# EAGLE design MagEnc (EAGLE 5.11)
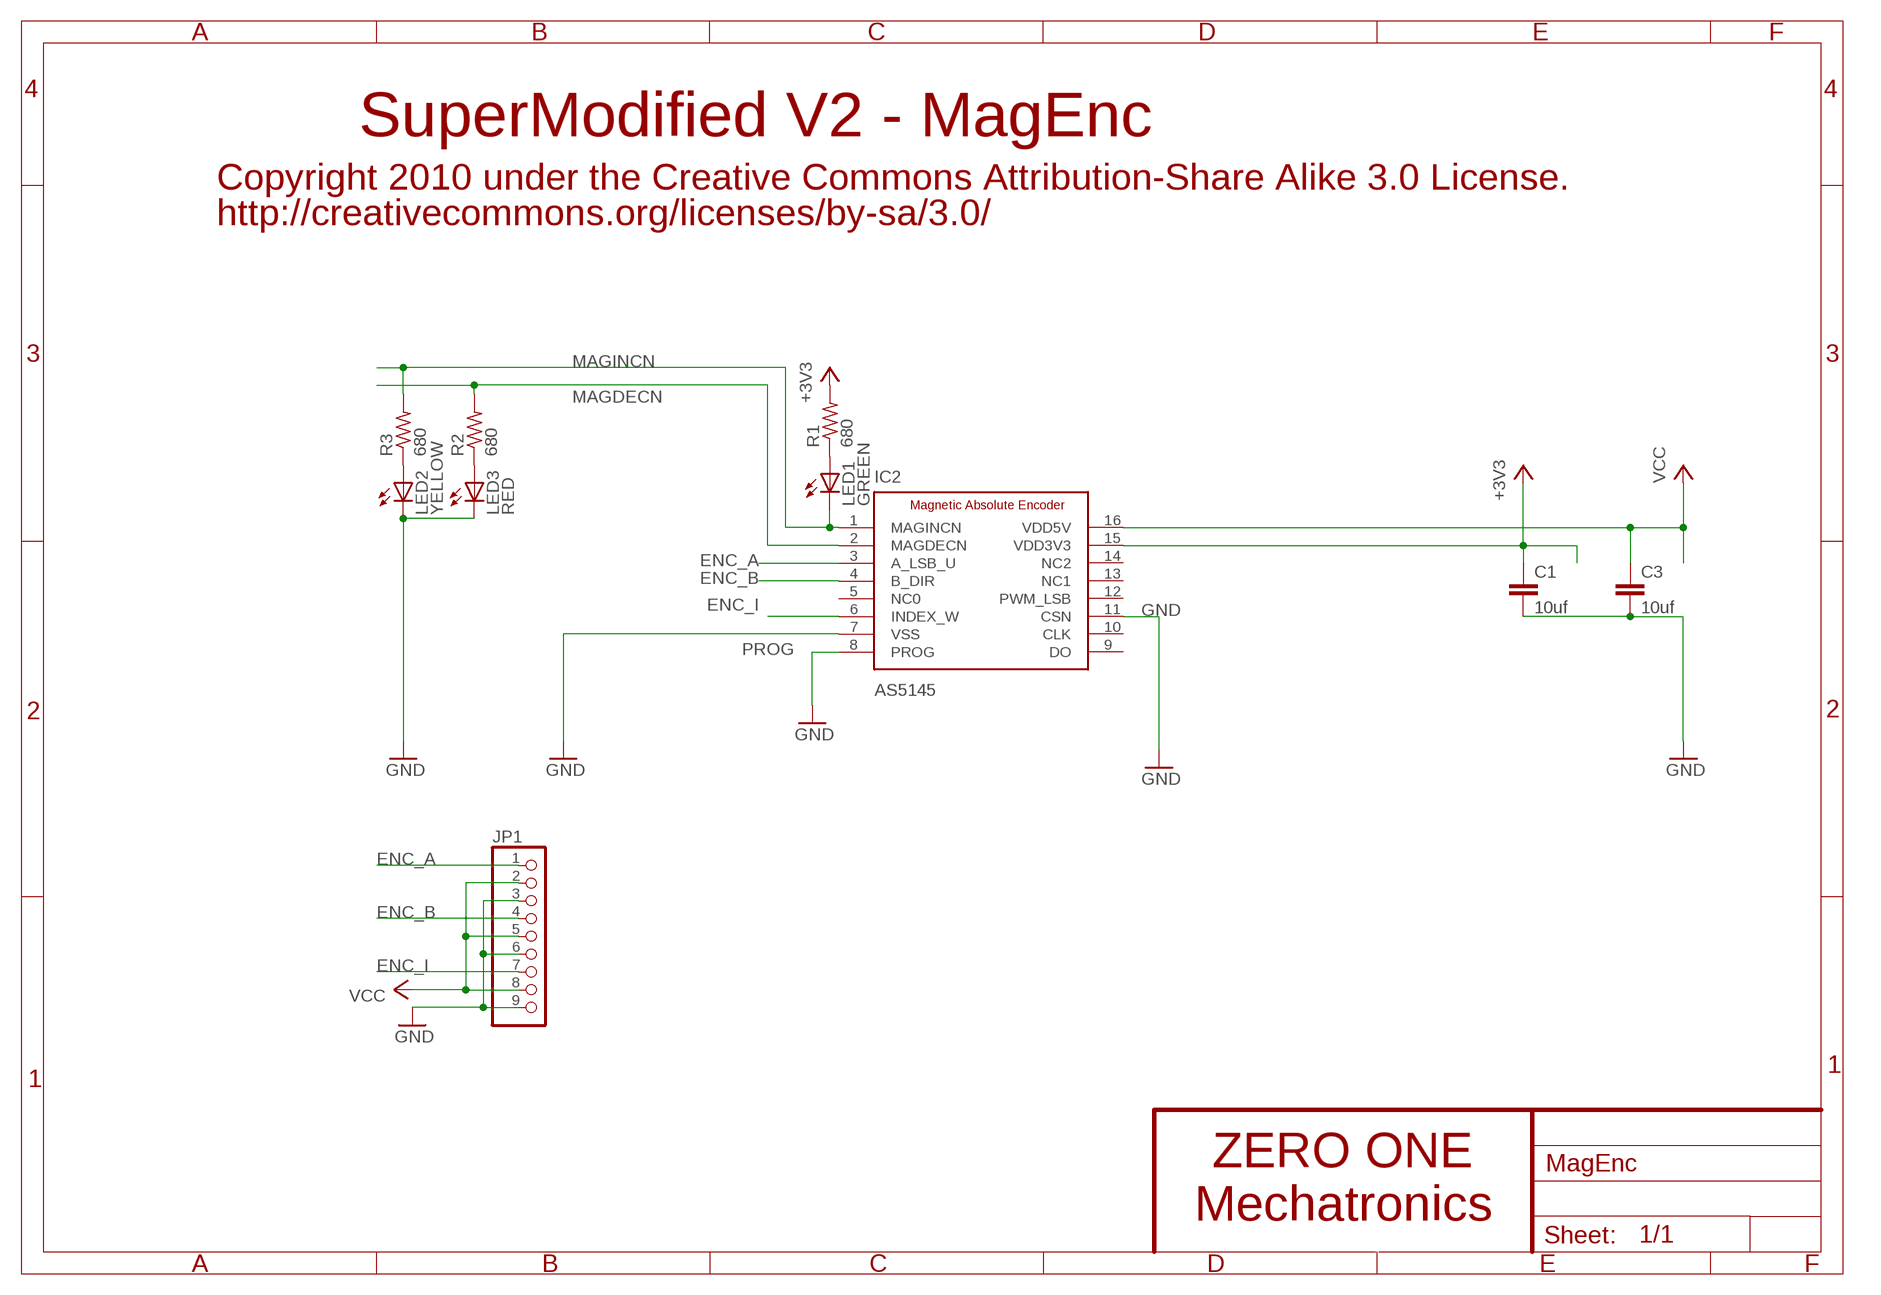
[diagram p0: schematic, sheet 1]

## Parts
C1  10uf  C-EUC0805K  [C0805K]
C3  10uf  C-EUC0805K  [C0805K]
IC2  AS5145  ADS5040  [SSOP16]
JP1  PINHD-1X9  [1X09]
LED1  GREEN  LEDCHIPLED_0805  [CHIPLED_0805]
LED2  YELLOW  LEDCHIPLED_0805  [CHIPLED_0805]
LED3  RED  LEDCHIPLED_0805  [CHIPLED_0805]
R1  680  R-US_R0603  [R0603]
R2  680  R-US_R0603  [R0603]
R3  680  R-US_R0603  [R0603]

## Nets
+3V3: C1.1 IC2.15(VDD3V3) R1.2
ENC_A: IC2.3(A_LSB_U) JP1.1
ENC_B: IC2.4(B_DIR) JP1.4
ENC_I: IC2.6(INDEX_W) JP1.7
GND: C1.2 C3.2 IC2.7(VSS) IC2.11(CSN) JP1.3 JP1.6 JP1.9 LED2.C LED3.C
MAGDECN: IC2.2(MAGDECN) R2.2
MAGINCN: IC2.1(MAGINCN) LED1.C R3.2
N$1: LED1.A R1.1
N$4: LED3.A R2.1
N$5: LED2.A R3.1
PROG: IC2.8(PROG) ; supply symbol labelled GND
VCC: C3.1 IC2.16(VDD5V) JP1.2 JP1.5 JP1.8
Unconnected: IC2.5(NC0) IC2.9(DO) IC2.10(CLK) IC2.12(PWM_LSB) IC2.13(NC1) IC2.14(NC2)

## Notes on the sheet
- SuperModified V2 - MagEnc
- Copyright 2010 under the Creative Commons Attribution-Share Alike 3.0 License.
- http://creativecommons.org/licenses/by-sa/3.0/
- ZERO ONE
- Mechatronics

## Library data of the parts
C1 C3 = rcl:C-EU: CAPACITOR, European symbol
IC2 = zo_TMS320DMC:ADS5040
JP1 = pinhead:PINHD-1X9: PIN HEADER
LED1-LED3 = led:LED: LED OSRAM: - CHIPLED LG R971, LG N971, LY N971, LG Q971, LY Q971, LO R971, LY R971 LH N974, LH R974 LS Q976, LO Q976, LY Q976 LO Q996 - Hyper CHIPLED LW Q18S LB Q993, LB Q99A, LB R99A - SideLED LS A670, LO A670, LY A670, LG A670, LP A670 LB A673, LV A673, LT A673, LW A673 LH A674 LY A675 LS A676, LA A676, LO A676, LY A676, LW A676 LS A679, LY A679, LG A679 - Hyper Micro SIDELED® LS Y876, LA Y876, LO Y876, LY Y876 LT Y87S - SmartLED LW L88C, LW L88S LB L89C, LB L89S, LG L890 LS L89K, LO L89K, LY L89K LS L896, LA L896, LO L896, LY L896 - TOPLED LS T670, LO T670, LY T670, LG T670, LP T670 LSG T670, LSP T670, LSY T670, LOP T670, LYG T670 LG T671, LOG T671, LSG T671 LB T673, LV T673, LT T673, LW T673 LH T674 LS T676, LA T676, LO T676, LY T676, LB T676, LH T676, LSB T676, LW T676 LB T67C, LV T67C, LT T67C, LS T67K, LO T67K, LY T67K, LW E67C LS E67B, LA E67B, LO E67B, LY E67B, LB E67C, LV E67C, LT E67C LW T67C LS T679, LY T679, LG T679 LS T770, LO T770, LY T770, LG T770, LP T770 LB T773, LV T773, LT T773, LW T773 LH T774 LS E675, LA E675, LY E675, LS T675 LS T776, LA T776, LO T776, LY T776, LB T776 LHGB T686 LT T68C, LB T68C - Hyper Mini TOPLED® LB M676 - Mini TOPLED Santana® LG M470 LS M47K, LO M47K, LY M47K Source: http://www.osram.convergy.de/
R1-R3 = rcl:R-US_: RESISTOR, American symbol

## Board
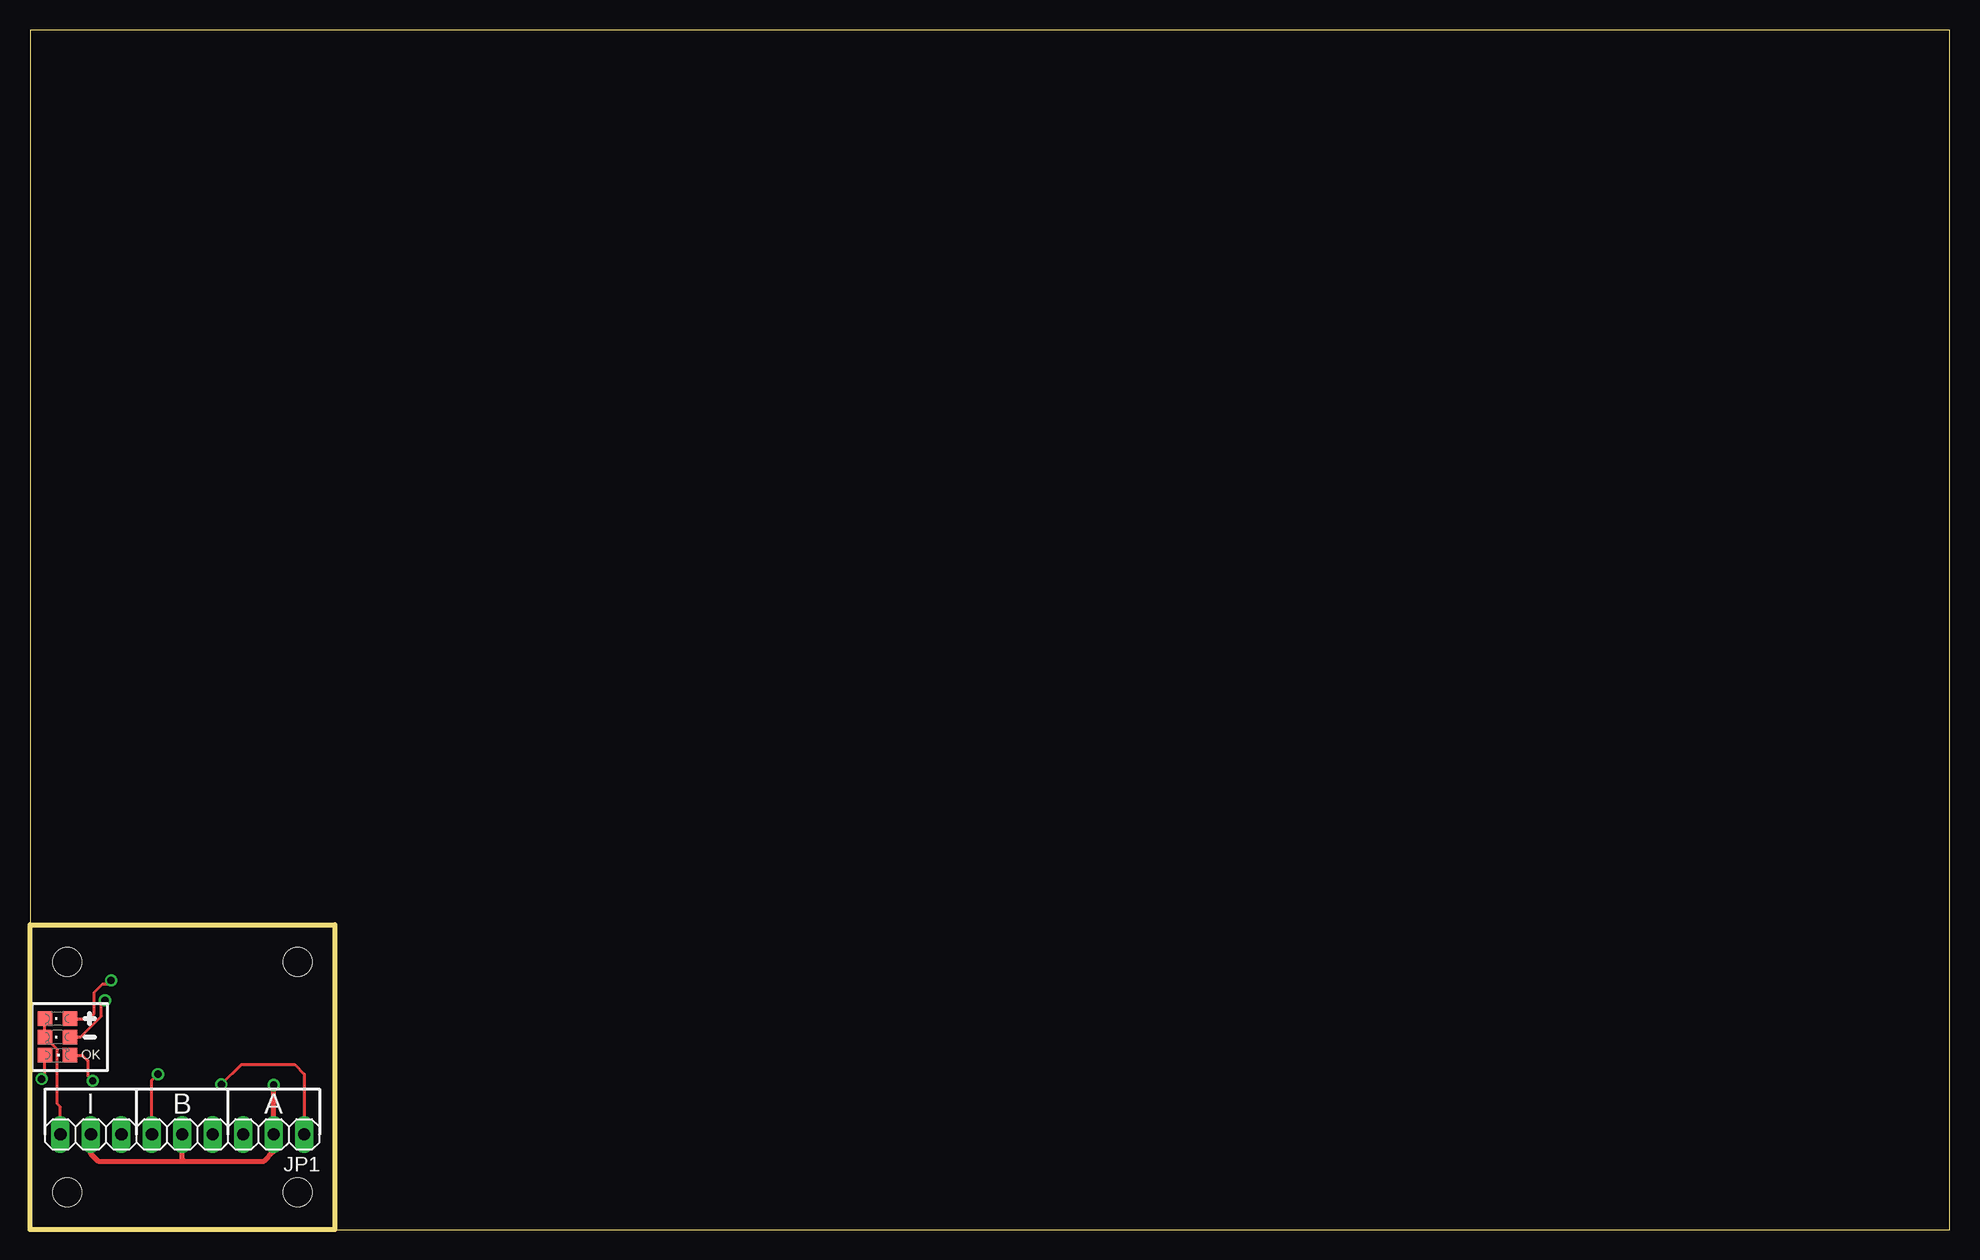
[diagram p1: board, top side]
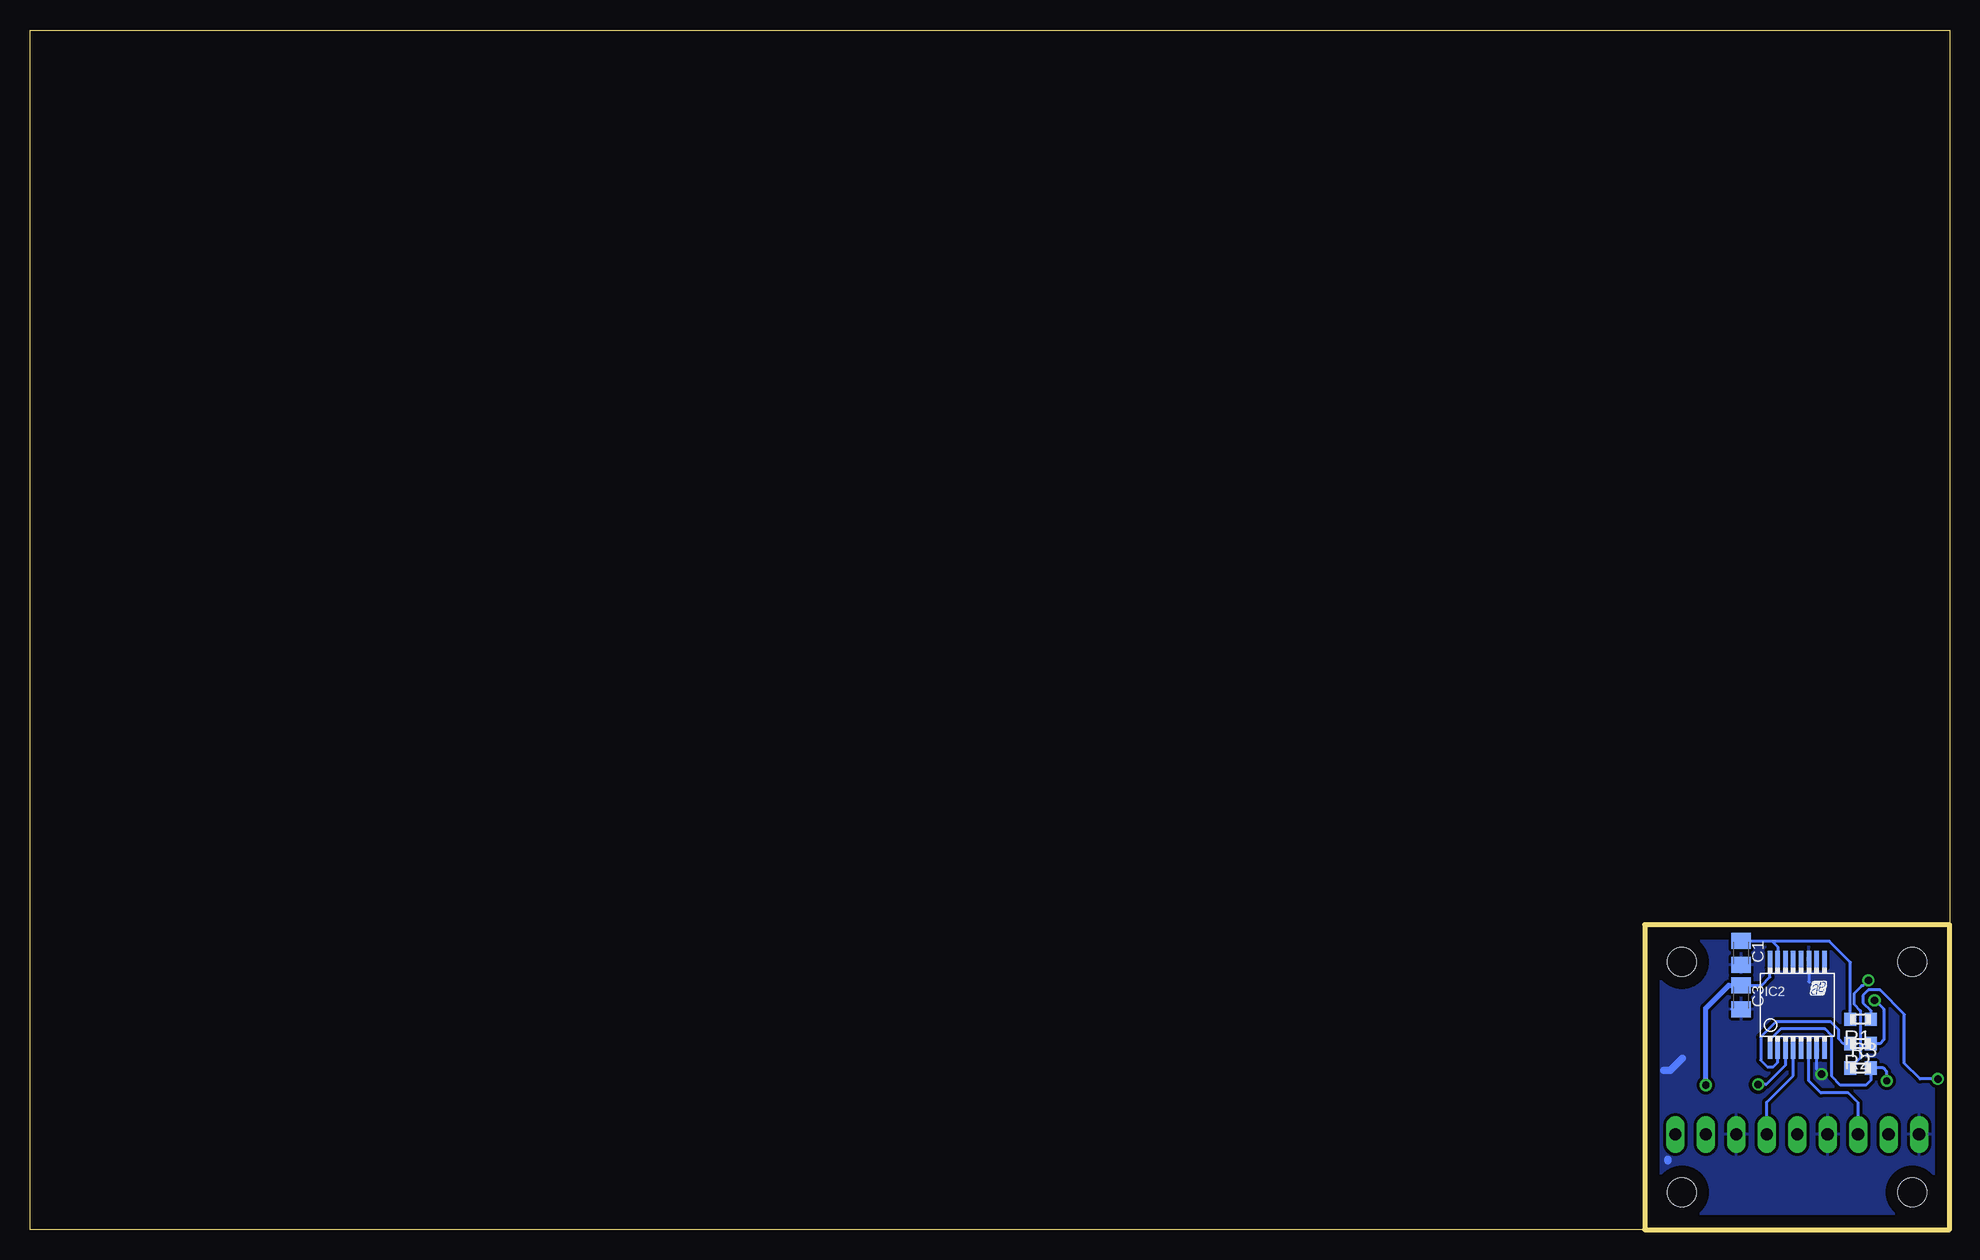
[diagram p2: board, bottom side, seen from below]

Size 160 x 100 mm. Coordinates in mm from the lower left corner, seen from the top.
Outline: 25.4,0 160,0 160,100 0,100 0,25.4
Outline: 0,25.4 0,0 25.4,0
Outline: 0,25.4 25.4,25.4 25.4,0
Copper layers (1*16): Top 0.035mm / dielectric 1.5mm / Bottom 0.035mm
Design rules "default": minimum track width 10mil, minimum drill 24mil, track to track 8mil, track to pad 8mil, pad to pad 8mil, via to via 8mil, smd to smd 8mil, copper to edge 40mil, drill to drill 8mil, minimum pad ring 10mil, minimum via ring 8mil, stop-mask expansion 4mil, vias tented up to drill 0mil, thermal gap 10mil
Holes 2.41 mm at -9.86,-1.88 3.1,22.3 22.3,22.3 3.1,3.1 22.3,3.1

### Footprints (pad centres in the part's own frame; a part is rotated, then mirrored left to right if it is on the bottom)
C0805K = smd 1.3 x 1.6: 1 -1,0; 2 1,0
SSOP16 = smd 0.381 x 1.422: 1 -2.275,-3.791; 2 -1.625,-3.791; 3 -0.975,-3.791; 4 -0.325,-3.791; 5 0.325,-3.791; 6 0.975,-3.791; 7 1.625,-3.791; 8 2.275,-3.791; 9 2.275,3.791; 10 1.625,3.791; 11 0.975,3.791; 12 0.325,3.791; 13 -0.325,3.791; 14 -0.975,3.791; 15 -1.625,3.791; 16 -2.275,3.791
1X09 = drill 1.016 long: 1 -10.16,0; 2 -7.62,0; 3 -5.08,0; 4 -2.54,0; 5 0,0; 6 2.54,0; 7 5.08,0; 8 7.62,0; 9 10.16,0
CHIPLED_0805 = smd 1.2 x 1.2: A 0,-1.05; C 0,1.05
R0603 = smd 1 x 1.1: 1 -0.85,0; 2 0.85,0

### Placement (x,y rotation side)
C1  17.37,23.06 270 bottom
C3  17.37,19.35 270 bottom
IC2  12.7,18.75 0 bottom
JP1  12.7,7.92 180 top
LED1  2.29,14.53 270 top
LED2  2.29,17.58 90 top
LED3  2.29,16.05 90 top
R1  7.42,17.53 180 bottom
R2  7.42,15.49 180 bottom
R3  7.42,13.46 0 bottom

### Tracks (layer width: path | path; a pad name or v marks a point on that pad's centre or on a via)
+3V3
  Bottom 0.254: C1.1 17.34,24.03 15.65,24.03 14.78,24.03 | 14.78,24.03 14.32,23.57 IC2.15 | R1.2 8.27,22.29 10.01,24.03 14.78,24.03
ENC_A  (via drill 0.6)
  Top 0.254: JP1.1 22.86,12.95 22.05,13.77 17.63,13.77 v15.95,12.09
  Bottom 0.254: IC2.3 13.68,13.71 15.29,12.09 v15.95,12.09
ENC_B
  Bottom 0.254: IC2.4 13.03,12.83 15.24,10.62 JP1.4
ENC_I
  Bottom 0.254: IC2.6 11.72,12.38 10.72,11.38 8.43,11.38 7.62,10.57 JP1.7
GND  (via drill 0.6)
  Top 0.254: LED2.C LED3.C 2.29,15 2.29,10.46 2.54,10.21 JP1.9 | v10.67,12.95 10.16,12.45 JP1.6
  Bottom 0.254: IC2.7 11.07,13.36 v10.67,12.95 | IC2.11 11.73,22.55 11.73,20.68 arc-90 11.68,20.62 | C3.2 18.17,18.36
  Bottom 0.61: 22.25,14.28 23.27,13.26 23.82,13.26 | 23.47,5.84 23.47,5.74
  pour Bottom (isolate 0.254): 0,25.4 25.4,25.4 25.4,0.05 0,0.05
MAGDECN
  Bottom 0.254: IC2.2 14.32,13.92 14.68,13.56 15.19,13.56 15.75,14.12 15.75,16.05 14.48,17.32 9.91,17.32 9.25,16.66 9.25,15.9 8.84,15.49 R2.2
MAGINCN  (via drill 0.6)
  Top 0.254: LED1.C 4.37,14.53 4.83,14.07 4.83,12.8 v5.23,12.39
  Bottom 0.254: v5.23,12.39 5.23,13.16 5.54,13.46 R3.2 6.57,12.43 6.96,12.04 9.09,12.04 9.8,12.75 9.8,16.15 10.36,16.71 14.07,16.71 14.97,15.81 IC2.1
N$1  (via drill 0.6)
  Top 0.254: LED1.A 1.24,12.82 v0.96,12.55
  Bottom 0.254: R1.1 6.57,18.25 7.21,18.9 7.21,19.51 6.76,19.96 5.79,19.96 3.76,17.93 3.76,13.87 2.44,12.55 v0.96,12.55
N$4  (via drill 0.6)
  Top 0.254: LED3.A 4.22,16.05 5.94,17.78 5.94,18.85 6.2,19.1 v6.25,19.1
  Bottom 0.254: R2.1 5.79,15.49 5.49,15.8 5.49,18.39 6.2,19.1 v6.25,19.1
N$5  (via drill 0.6)
  Top 0.254: LED2.A 4.93,17.58 5.33,17.98 5.33,19.76 6.04,20.47 6.45,20.47 v6.76,20.78
  Bottom 0.254: R3.1 7.42,14.31 7.42,18.24 7.98,18.8 7.98,19.66 7.32,20.32 7.21,20.32 v6.76,20.78
VCC  (via drill 0.6)
  Top 0.406: 12.85,5.69 5.69,5.69 5.08,6.3 JP1.8 | 12.85,5.69 19.51,5.69 20.32,6.5 JP1.2 v20.32,12.04 | JP1.5 12.7,5.84 12.85,5.69
  Bottom 0.254: IC2.16 14.97,21.04 15.66,20.36 C3.1
  Bottom 0.406: C3.1 18.41,20.36 20.32,18.44 v20.32,12.04

### Text on the board
tPlace: OK | I | B | A